# EAGLE schematic lock-shield (EAGLE 6.5.0)
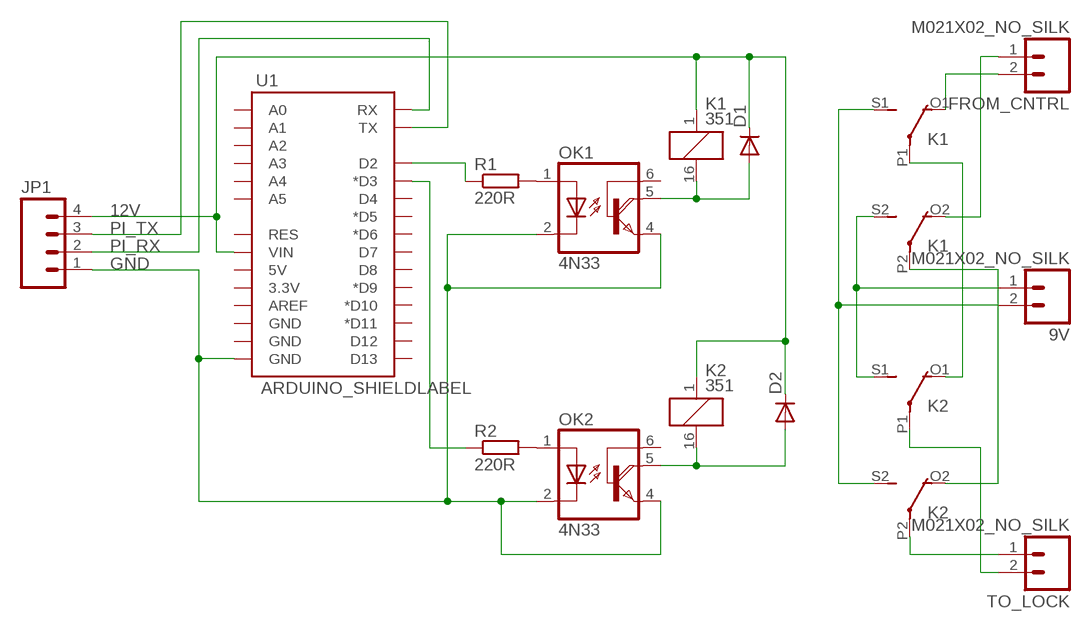
[diagram p0: schematic, sheet 1]

## Parts
9V  M021X02_NO_SILK  [1X02_NO_SILK]
D1  DIODE1N4148  [DIODE-1N4148]
D2  DIODE1N4148  [DIODE-1N4148]
FROM_CNTRL  M021X02_NO_SILK  [1X02_NO_SILK]
JP1  M041X04_NO_SILK  [1X04_NO_SILK]
K1  351  [351]
K2  351  [351]
OK1  4N33  [DIL06]
OK2  4N33  [DIL06]
R1  220R  R-EU_0309/10  [0309/10]
R2  220R  R-EU_0309/10  [0309/10]
TO_LOCK  M021X02_NO_SILK  [1X02_NO_SILK]
U1  ARDUINO_SHIELDLABEL  [DUEMILANOVE_SHIELD]

## Nets
12V: D1.C D2.C JP1.4 K1.1 K2.1 U1.VIN
GND: JP1.1 OK1.2(C) OK1.4(E) OK2.2(C) OK2.4(E) U1.GND@0(GND)
N$1: OK1.1(A) R1.2
N$2: OK2.1(A) R2.2
N$3: R1.1 U1.D2
N$4: R2.1 U1.D3(*D3)
N$5: FROM_CNTRL.2 K1.O1(2:O)
N$6: FROM_CNTRL.1 K1.O2(3:O)
N$7: K2.P1(2:P) TO_LOCK.2
N$8: K1.P1(2:P) K2.O1(2:O)
N$9: K2.P2(3:P) TO_LOCK.1
N$10: D1.A K1.16 OK1.5(COL)
N$11: D2.A K2.16 OK2.5(COL)
N$12: K1.P2(3:P) K2.O2(3:O)
N$13: 9V.1 K1.S2(3:S) K2.S1(2:S)
N$14: 9V.2 K1.S1(2:S) K2.S2(3:S)
PI_RX: JP1.2 U1.RX
PI_TX: JP1.3 U1.TX
Unconnected: OK1.6(B) OK2.6(B) U1.3.3V U1.5V U1.A0 U1.A1 U1.A2 U1.A3 U1.A4 U1.A5 U1.AREF U1.D4 U1.D5(*D5) U1.D6(*D6) U1.D7 U1.D8 U1.D9(*D9) U1.D10(*D10) U1.D11(*D11) U1.D12 U1.D13 U1.GND@1(GND) U1.GND@2(GND) U1.RES

## Library data of the parts
9V FROM_CNTRL TO_LOCK = SparkFun-Connectors:M02: Standard 2-pin 0.1" header. Use with - straight break away headers ( PRT-00116) - right angle break away headers (PRT-00553) - swiss pins (PRT-00743) - machine pins (PRT-00117) - female headers (PRT-00115) Molex polarized connector foot print use with: PRT-08233 with associated crimp pins and housings. 2.54_SCREWTERM for use with PRT-10571. 3.5mm Screw Terminal footprints for PRT-08084 5mm Screw Terminal footprints for use with PRT-08433
D1 D2 = SparkFun-DiscreteSemi:DIODE: Diode These are standard reverse protection diodes and small signal diodes. SMA package can handle up to about 1A. SOD-323 can handle about 200mA. What the SOD-323 package when ordering, there are some mfgs out there that are 5-pin packages.
JP1 = SparkFun-Connectors:M04: Header 4 Standard 4-pin 0.1" header. Use with straight break away headers (SKU : PRT-00116), right angle break away headers (PRT-00553), swiss pins (PRT-00743), machine pins (PRT-00117), and female headers (PRT-00115). Molex polarized connector foot print use with SKU : PRT-08231 with associated crimp pins and housings. 1MM SMD Version SKU: PRT-10208
K1 K2 = relay:351: RELAY 2 x switch, Omron; OC_FARNELL: unknown; OC_NEWARK: unknown
OK1 OK2 = optocoupler:4N33: MOTOROLA OPTO COUPLER; MF: VISHAY/TELEFUNKEN; MPN: 4N33; OC_FARNELL: 1469601; OC_NEWARK: 88K1390
R1 R2 = resistor:R-EU_: RESISTOR, European symbol
U1 = SparkFun-Boards:ARDUINO_SHIELD: Arduino shield footprint